# Altium schematic sheet LT5560.SchDoc
size A2; SheetNumber: 1; SheetTotal: 1
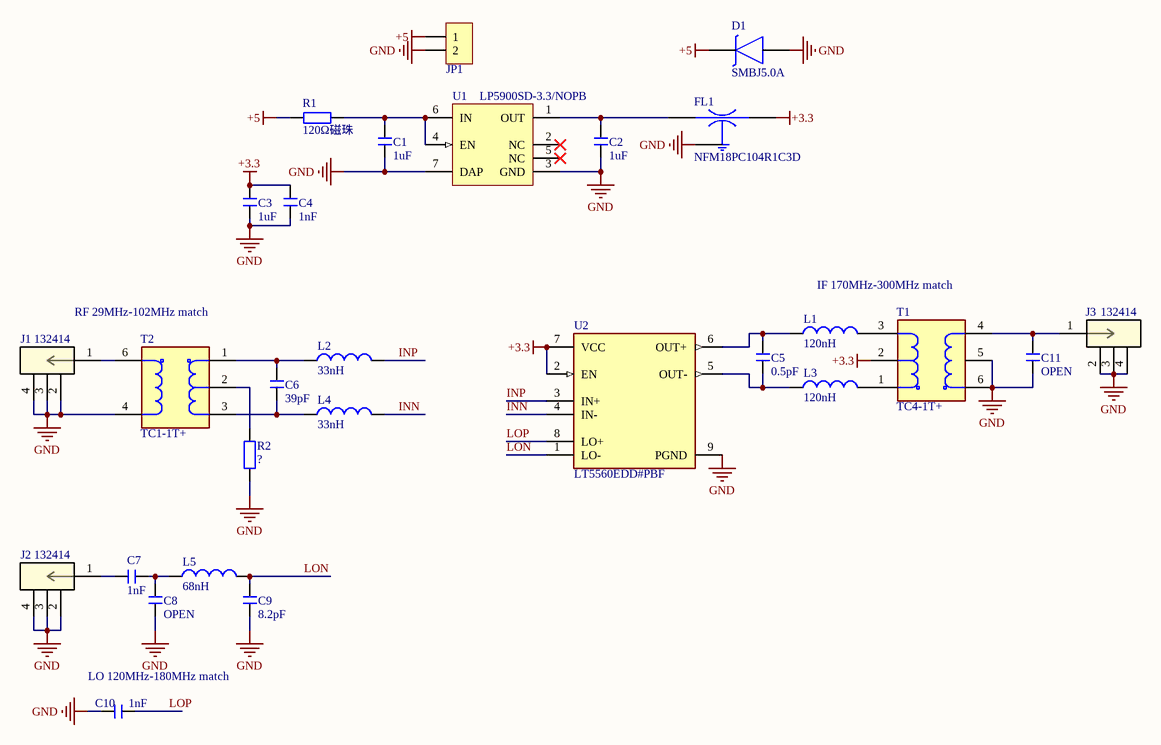
[diagram p0: LT5560.SchDoc]

## Parts
C1  1uF  [C 0603_L]
C2  1uF  [C 0603_L]
C3  1uF  [C 0603_L]
C4  1nF  [C 0603_L]
C5  0.5pF  [C 0603_L]
C6  39pF  [C 0603_L]
C7  1nF  [C 0603_L]
C8  OPEN  [C 0603_L]
C9  8.2pF  [C 0603_L]
C10  1nF  [C 0603_L]
C11  OPEN  [C 0603_L]
D1  SMBJ5.0A  [SMBJ5.0A]
FL1  NFM18PC104R1C3D  [FIL_NFM18PC104R1C3D]
J1  132414  [CONN_132414_AMP]
J2  132414  [CONN_132414_AMP]
J3  132414  [CONN_132414_AMP]
JP1  HDR-1X2  [KF2510-LI-2P]  (value not drawn)
L1  120nH  [L 0603]
L2  33nH  [L 0603]
L3  120nH  [L 0603]
L4  33nH  [L 0603]
L5  68nH  [L 0603]
R1  120Ω磁珠  [R 0603_L]
R2  ?  [R 0603_L]
T1  TC4-1T+  [TC4-1T+-Footprint-1]
T2  TC1-1T+  [FP-TC1-1-13M+-MFG]
U1  LP5900SD-3.3/NOPB  [LP5900-3.3/NOPB]
U2  LT5560EDD#PBF  [FP-DD-8-05-08-1698-MFG]

## Nets
+3.3: C3.2 C4.2 FL1.3(OUT) T1.2(SECONDARY) U2.2(EN) U2.7(VCC)
+5: D1.1(K) JP1.1 R1.1
GND: C1.1 C2.1 C3.1 C4.1 C8.1 C9.1 C10.1 C11.1 D1.2(A) FL1.2(GND) J1.2 J1.3 J1.4 J2.2 J2.3 J2.4 J3.2 J3.3 J3.4 JP1.2 R2.1 T1.5(NC) T1.6(PRIMARY_DOT) T2.4(PRIMARY) U1.3(GND) U1.7(DAP) U2.9(PGND)
INN: L4.2 U2.4(IN-)
INP: L2.2 U2.3(IN+)
LON: C9.2 L5.2 U2.1(LO-)
LOP: C10.2 U2.8(LO+)
NetC1_2: C1.2 R1.2 U1.4(EN) U1.6(IN)
NetC2_2: C2.2 FL1.1(IN) U1.1(OUT)
NetC5_1: C5.1 L3.1 U2.5(OUT-)
NetC5_2: C5.2 L1.1 U2.6(OUT+)
NetC6_1: C6.1 L4.1 T2.3(SECONDARY_MID)
NetC6_2: C6.2 L2.1 T2.1(SECONDARY_DOT)
NetC7_1: C7.1 J2.1
NetC7_2: C7.2 C8.2 L5.1
NetC11_2: C11.2 J3.1 T1.4(PRIMARY)
NetJ1_1: J1.1 T2.6(PRIMARY_DOT)
NetL1_2: L1.2 T1.3(SECONDARY_MID)
NetL3_2: L3.2 T1.1(SECONDARY_DOT)
NetR2_2: R2.2 T2.2(SECONDARY)

Not connected (* = marked no-connect by the designer): U1 2(NC)* 5(NC)*

## Notes on the sheet
- IF 170MHz-300MHz match
- RF 29MHz-102MHz match
- (near C10) LO 120MHz-180MHz match

## Library data of the parts
C1-C11 = C: 贴片电容; 淘宝ID: 小糖豆的小窝窝; BOM名称: 贴片电容; 下单链接: https://item.taobao.com/item.htm?ft=t&id=613637044352
D1 = SMBJ5.0A: SMBJX.XA Seires TVS; MF: Littelfuse; Package: DO-214 Littelfuse; SnapEDA_Link: https://www.snapeda.com/parts/SMBJ5.0A/Littelfuse+Inc/view-part/?ref=snap; Purchase-URL: https://pricing.snapeda.com/search/part/SMBJ5.0A/?ref=eda; Check_prices: https://www.snapeda.com/parts/SMBJ5.0A/Littelfuse+Inc/view-part/?ref=eda; MP: SMBJ5.0A; Price: None; Availability: In Stock; Value: *
FL1 = NFM18PC104R1C3D: SMD Capacitor with Capacitance: 0.10uF Tol. 20%. Rated Voltage: 16Vdc; MF: Murata; Digi-Key_Part_Number: 490-6969-1-ND; SnapEDA_Link: https://www.snapeda.com/parts/NFM18PC104R1C3D/Murata/view-part/4375738/?ref=snap; Package: NONSTANDARD; MP: NFM18PC104R1C3D; Digi-Key_Purchase_URL: https://www.digikey.com/product-detail/en/murata-electronics/NFM18PC104R1C3D/490-6969-1-ND/3846166?utm_source=snapeda&utm_medium=aggregator&utm_campaign=symbol; Value: *
J1-J3 = 132414: No Description Available; Mfr_Name: Amphenol ICC; Copyright: Copyright (C) 2022 Ultra Librarian. All rights reserved.; Manufacturer_Part_Number: 132414; RefDes: RefDes; Type: DEV
JP1 = Header 2: 2P接插件; 淘宝ID: 小糖豆的小窝窝; BOM名称: 2P接插件; 下单链接: https://item.taobao.com/item.htm?ft=t&id=613637044352
L1-L5 = L: 小功率贴片电感; BOM名称: 小功率贴片电感; 下单链接: https://item.taobao.com/item.htm?ft=t&id=613637044352
R1 R2 = R: 贴片电阻; 淘宝ID: 小糖豆的小窝窝; BOM名称: 贴片电阻; 下单链接: https://item.taobao.com/item.htm?ft=t&id=613637044352
T1 = TC4-1T+: Xfmr, Isolation, 50 ohm, 4: 1, 0.5-300 MHz, SMT
T2 = CMP-00025-00004-7: RF Transformer 1: 1 5 Terminal SMD; RoHS Compliant: No
U1 = LP5900SD-3.3/NOPB: Ultra Low Noise, 150mA Linear Regulator for RF/Analog Circuits Requires No Bypass Capacitor, 6-pin LLP, Pb-Free; Manufacturer: Texas Instruments; PackageTopMarking: XTT*L16; CompType: LDO IC; PowerWise: N; ComponentLink1URL: http://www.ti.com/general/docs/lit/getliterature.tsp?genericPartNumber=LP5900&fileType=pdf; PinCount: 6; PackageDescription: LLP, Plastic, Dual, 2.2 x 2.5 x 0.8mm Body, 6 Lead, 0.65mm Pitch, No Pullback; RoHS: Y; ComponentLink1Description: Datasheet URL; PackageReference: NGF0006A
U2 = LT5560EDD: IC MIXER 10KHZ-4GHZ UP/DWN 8DFN; Max Frequency: 4GHz; Max Supply Voltage: 5V; Min Frequency: 10kHz; Min Supply Voltage: 2.7V; Power Gain: 2.7dB; Noise Figure: 9.3dB; Gain: 2.4dB; Operating Supply Voltage: 3V; Operating Supply Current: 12mA; Length: 3mm; Mount: Surface Mount; Width: 3mm; Frequency: 10kHz; Lead Free: Lead Free; Bandwidth: 4GHz; Height: 0.7mm; Package Quantity: 121; Packaging: Rail/Tube; Series: LT5560; Case/Package: DFN; Number of Pins: 8; RoHS Compliant: Yes; Max Operating Temperature: 85°C; Radiation Hardening: No; Min Operating Temperature: -40°C